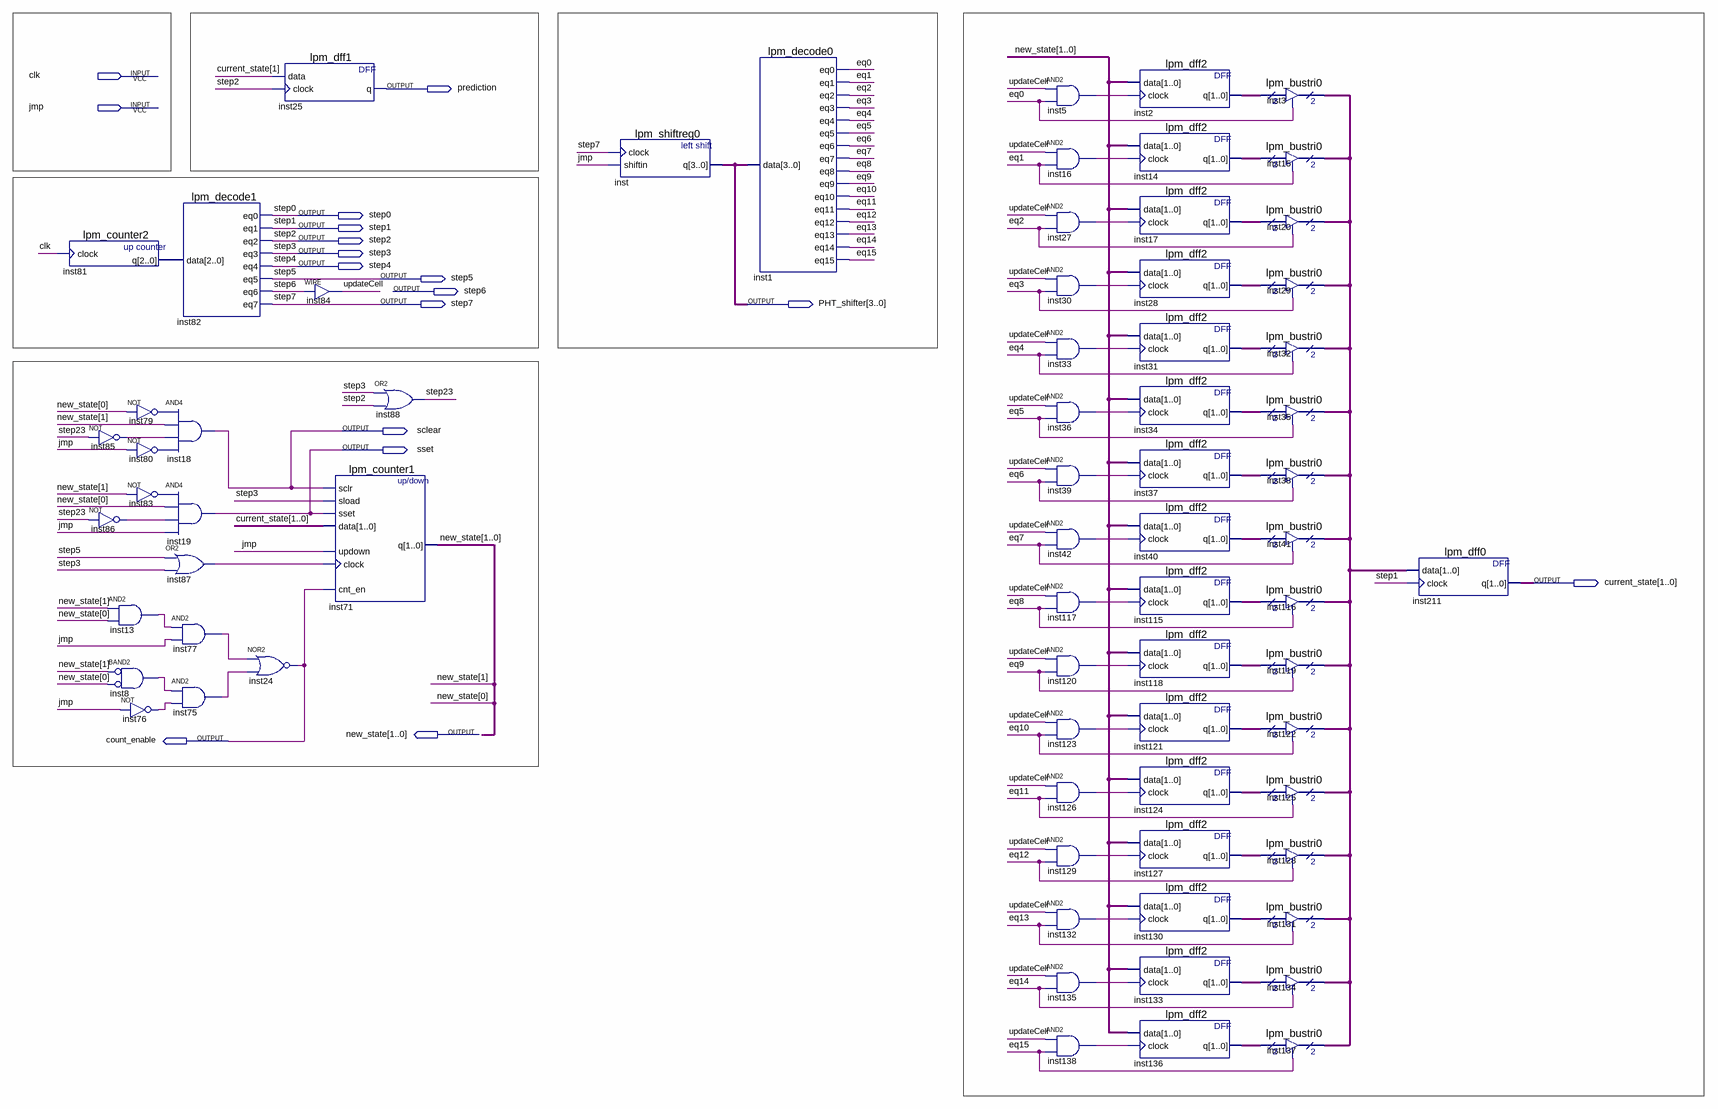
[diagram p0: schematic sheet]
// Quartus schematic Prediction.bdf as structural Verilog: 71 symbols, 17 pins
module Prediction (
  input  clk,
  input  jmp,
  output prediction,
  output step0,
  output step1,
  output step2,
  output step3,
  output step4,
  output step5,
  output step6,
  output step7,
  output [3:0] PHT_shifter,
  output sclear,
  output sset,
  output [1:0] current_state,
  output [1:0] new_state,
  output count_enable
);

  wire eq0, eq1, eq2, eq3, eq4, eq5, eq6, eq7, eq8, eq9, eq10, eq11, eq12, eq13, eq14, eq15, inst5_out,
       inst8_out, inst13_out, inst16_out, inst27_out, inst30_out, inst33_out, inst36_out, inst39_out,
       inst42_out, inst75_out, inst76_out, inst77_out, inst79_out, inst80_out, inst83_out, inst85_out,
       inst86_out, inst87_out, inst117_out, inst120_out, inst123_out, inst126_out, inst129_out, inst132_out,
       inst135_out, inst138_out, step23, updateCell;
  wire [1:0] inst2_q, inst3_tridata, inst14_q, inst17_q, inst28_q, inst31_q, inst34_q, inst37_q, inst40_q,
       inst115_q, inst118_q, inst121_q, inst124_q, inst127_q, inst130_q, inst133_q, inst136_q;
  wire [2:0] inst81_q;

  lpm_counter2 inst81 (.clock(clk), .q(inst81_q));
  not inst79 (inst79_out, new_state[0]);
  not inst85 (inst85_out, step23);
  not inst80 (inst80_out, jmp);
  not inst83 (inst83_out, new_state[1]);
  not inst86 (inst86_out, step23);
  and inst13 (inst13_out, new_state[1], new_state[0]);
  and inst8 (inst8_out, ~new_state[1], ~new_state[0]);  // BAND2
  not inst76 (inst76_out, jmp);
  lpm_decode1 inst82 (
    .data(inst81_q), .eq0(step0), .eq1(step1), .eq2(step2), .eq3(step3), .eq4(step4), .eq5(step5),
    .eq6(step6), .eq7(step7));
  and inst18 (sclear, inst79_out, new_state[1], inst85_out, inst80_out);
  and inst19 (sset, inst83_out, new_state[0], inst86_out, jmp);
  or inst87 (inst87_out, step5, step3);
  and inst77 (inst77_out, inst13_out, jmp);
  and inst75 (inst75_out, inst8_out, inst76_out);
  lpm_dff1 inst25 (.data(current_state[1]), .clock(step2), .q(prediction));
  nor inst24 (count_enable, inst77_out, inst75_out);
  assign updateCell = step6;  // WIRE inst84
  lpm_counter1 inst71 (
    .sclr(sclear), .sload(step3), .sset(sset), .data(current_state), .updown(jmp), .clock(inst87_out),
    .cnt_en(count_enable), .q(new_state));
  or inst88 (step23, step3, step2);
  lpm_shiftreg0 inst (.clock(step7), .shiftin(jmp), .q(PHT_shifter));
  lpm_decode0 inst1 (
    .data(PHT_shifter), .eq0(eq0), .eq1(eq1), .eq2(eq2), .eq3(eq3), .eq4(eq4), .eq5(eq5), .eq6(eq6),
    .eq7(eq7), .eq8(eq8), .eq9(eq9), .eq10(eq10), .eq11(eq11), .eq12(eq12), .eq13(eq13), .eq14(eq14),
    .eq15(eq15));
  and inst5 (inst5_out, updateCell, eq0);
  and inst16 (inst16_out, updateCell, eq1);
  and inst27 (inst27_out, updateCell, eq2);
  and inst30 (inst30_out, updateCell, eq3);
  and inst33 (inst33_out, updateCell, eq4);
  and inst36 (inst36_out, updateCell, eq5);
  and inst39 (inst39_out, updateCell, eq6);
  and inst42 (inst42_out, updateCell, eq7);
  and inst117 (inst117_out, updateCell, eq8);
  and inst120 (inst120_out, updateCell, eq9);
  and inst123 (inst123_out, updateCell, eq10);
  and inst126 (inst126_out, updateCell, eq11);
  and inst129 (inst129_out, updateCell, eq12);
  and inst132 (inst132_out, updateCell, eq13);
  and inst135 (inst135_out, updateCell, eq14);
  and inst138 (inst138_out, updateCell, eq15);
  lpm_dff2 inst2 (.data(new_state), .clock(inst5_out), .q(inst2_q));
  lpm_dff2 inst14 (.data(new_state), .clock(inst16_out), .q(inst14_q));
  lpm_dff2 inst17 (.data(new_state), .clock(inst27_out), .q(inst17_q));
  lpm_dff2 inst28 (.data(new_state), .clock(inst30_out), .q(inst28_q));
  lpm_dff2 inst31 (.data(new_state), .clock(inst33_out), .q(inst31_q));
  lpm_dff2 inst34 (.data(new_state), .clock(inst36_out), .q(inst34_q));
  lpm_dff2 inst37 (.data(new_state), .clock(inst39_out), .q(inst37_q));
  lpm_dff2 inst40 (.data(new_state), .clock(inst42_out), .q(inst40_q));
  lpm_dff2 inst115 (.data(new_state), .clock(inst117_out), .q(inst115_q));
  lpm_dff2 inst118 (.data(new_state), .clock(inst120_out), .q(inst118_q));
  lpm_dff2 inst121 (.data(new_state), .clock(inst123_out), .q(inst121_q));
  lpm_dff2 inst124 (.data(new_state), .clock(inst126_out), .q(inst124_q));
  lpm_dff2 inst127 (.data(new_state), .clock(inst129_out), .q(inst127_q));
  lpm_dff2 inst130 (.data(new_state), .clock(inst132_out), .q(inst130_q));
  lpm_dff2 inst133 (.data(new_state), .clock(inst135_out), .q(inst133_q));
  lpm_dff2 inst136 (.data(new_state), .clock(inst138_out), .q(inst136_q));
  lpm_bustri0 inst3 (.enabledt(eq0), .data(inst2_q), .tridata(inst3_tridata));
  lpm_bustri0 inst15 (.enabledt(eq1), .data(inst14_q), .tridata(inst3_tridata));
  lpm_bustri0 inst20 (.enabledt(eq2), .data(inst17_q), .tridata(inst3_tridata));
  lpm_bustri0 inst29 (.enabledt(eq3), .data(inst28_q), .tridata(inst3_tridata));
  lpm_bustri0 inst32 (.enabledt(eq4), .data(inst31_q), .tridata(inst3_tridata));
  lpm_bustri0 inst35 (.enabledt(eq5), .data(inst34_q), .tridata(inst3_tridata));
  lpm_bustri0 inst38 (.enabledt(eq6), .data(inst37_q), .tridata(inst3_tridata));
  lpm_bustri0 inst41 (.enabledt(eq7), .data(inst40_q), .tridata(inst3_tridata));
  lpm_bustri0 inst116 (.enabledt(eq8), .data(inst115_q), .tridata(inst3_tridata));
  lpm_bustri0 inst119 (.enabledt(eq9), .data(inst118_q), .tridata(inst3_tridata));
  lpm_bustri0 inst122 (.enabledt(eq10), .data(inst121_q), .tridata(inst3_tridata));
  lpm_bustri0 inst125 (.enabledt(eq11), .data(inst124_q), .tridata(inst3_tridata));
  lpm_bustri0 inst128 (.enabledt(eq12), .data(inst127_q), .tridata(inst3_tridata));
  lpm_bustri0 inst131 (.enabledt(eq13), .data(inst130_q), .tridata(inst3_tridata));
  lpm_bustri0 inst134 (.enabledt(eq14), .data(inst133_q), .tridata(inst3_tridata));
  lpm_bustri0 inst137 (.enabledt(eq15), .data(inst136_q), .tridata(inst3_tridata));
  lpm_dff0 inst211 (.data(inst3_tridata), .clock(step1), .q(current_state));
endmodule
